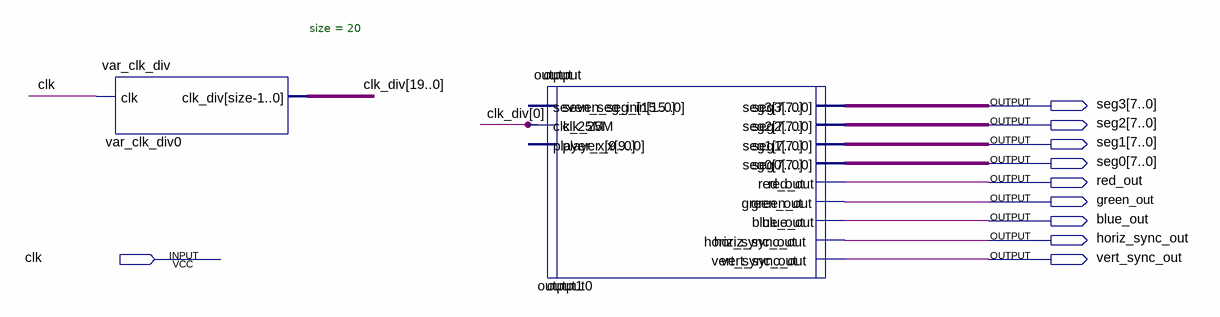
[diagram p0: schematic sheet]
// Quartus schematic test_ouput.bdf as structural Verilog: 3 symbols, 10 pins
module test_ouput (
  input  clk,
  output [7:0] seg3,
  output [7:0] seg2,
  output [7:0] seg1,
  output [7:0] seg0,
  output red_out,
  output green_out,
  output blue_out,
  output horiz_sync_out,
  output vert_sync_out
);

  wire [19:0] clk_div;

  var_clk_div #(.size(20)) var_clk_div0 (.clk(clk), .clk_div(clk_div));
  \output  output0 (
    .clk_25M(clk_div[0]), .seg3(seg3), .seg2(seg2), .seg1(seg1), .seg0(seg0), .red_out(red_out),
    .green_out(green_out), .blue_out(blue_out), .horiz_sync_out(horiz_sync_out), .vert_sync_out(vert_sync_out));  // open: seven_seg_in, player_x
  \output  output1 (.clk_25M(clk_div[0]));  // open: seven_seg_in, player_x, seg3, seg2, seg1, seg0, red_out, green_out, blue_out, horiz_sync_out, vert_sync_out
endmodule
